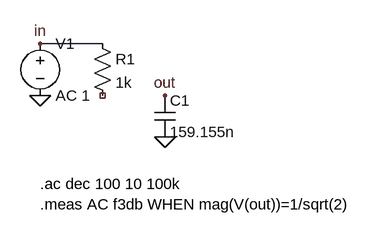
[diagram p0: schematic rc-nc-error.asc]
rc-nc-error.asc, the LTspice schematic file:
Version 4
SHEET 1 880 680
WIRE 0 16 96 16
FLAG 0 96 0
FLAG 192 160 0
FLAG 0 16 in
FLAG 192 96 out
SYMBOL voltage 0 0 R0
SYMATTR InstName V1
SYMATTR Value AC 1
SYMBOL res 80 0 R0
SYMATTR InstName R1
SYMATTR Value 1k
SYMBOL cap 176 96 R0
SYMATTR InstName C1
SYMATTR Value 159.155n
TEXT 0 232 Left 2 !.ac dec 100 10 100k
TEXT 0 264 Left 2 !.meas AC f3db WHEN mag(V(out))=1/sqrt(2)

The netlist it stands for:
* rc-nc-error.asc
V1 in 0 AC 1
R1 in NC_01 1k
C1 out 0 159.155n
.ac dec 100 10 100k
.meas AC f3db WHEN mag(V(out))=1/sqrt(2)
.backanno
.end